# Altium schematic sheet RA3003-A-1.SchDoc
size A4
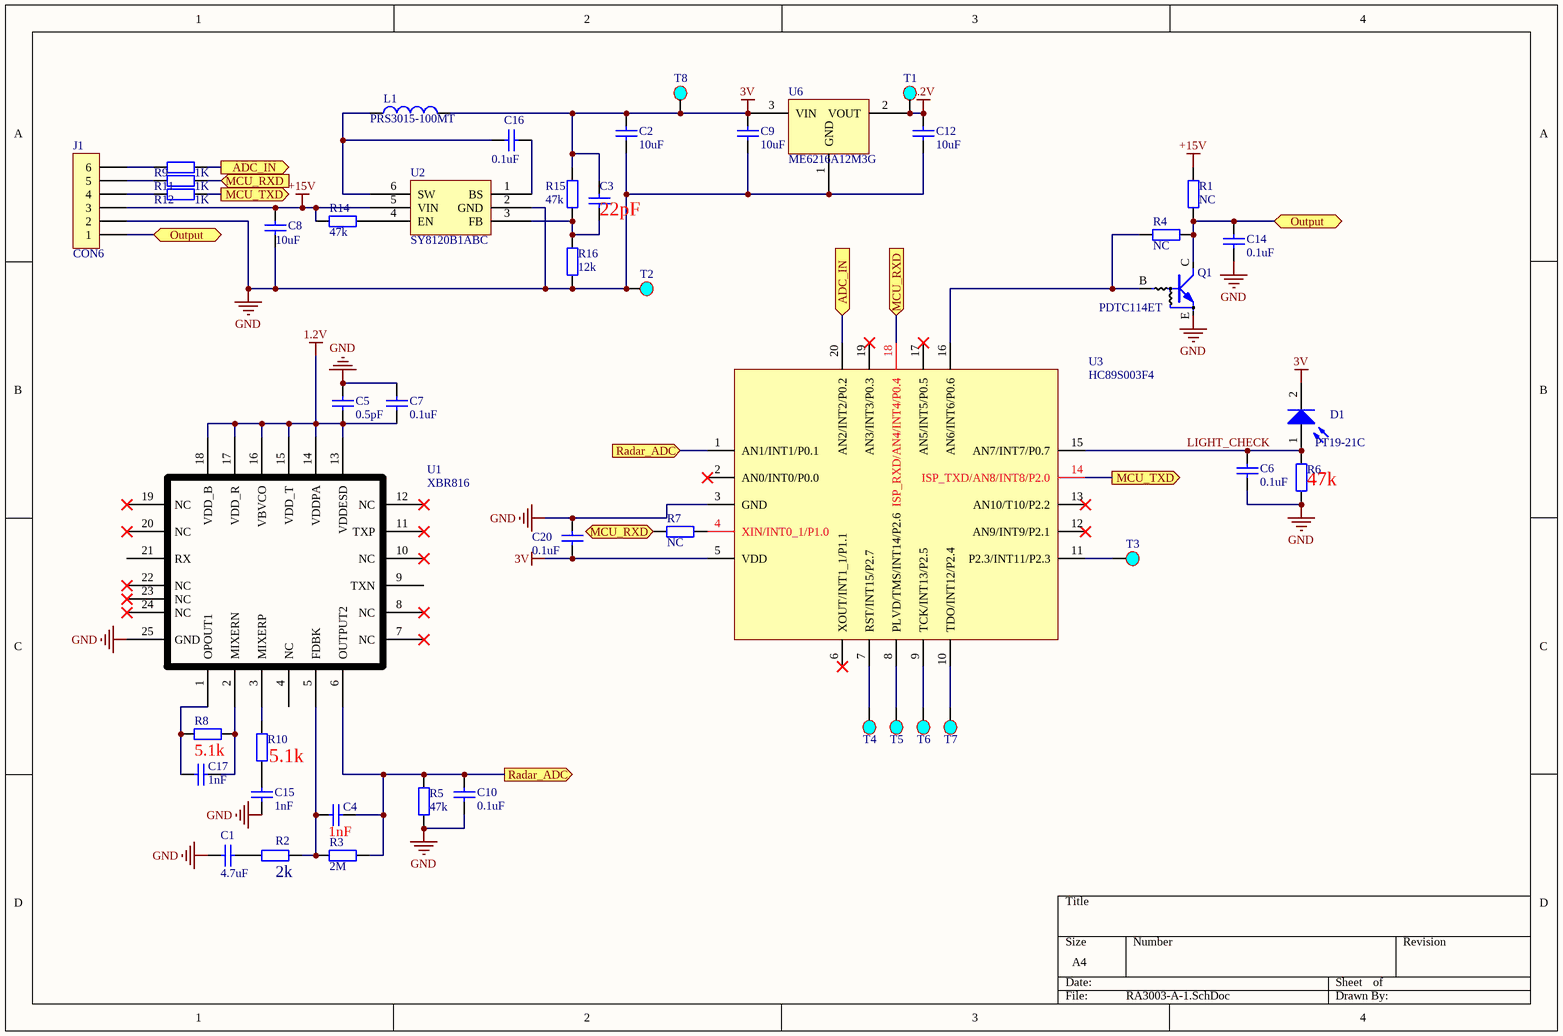
[diagram p0: RA3003-A-1.SchDoc]

## Parts
C1  4.7uF  [C0402]
C2  10uF  [C0402]
C3  22pF  [C0402]
C4  1nF  [C0402]
C5  0.5pF  [C0402]
C6  0.1uF  [C0402]
C7  0.1uF  [C0402]
C8  10uF  [C0603]
C9  10uF  [C0402]
C10  0.1uF  [C0402]
C12  10uF  [C0402]
C14  0.1uF  [C0402]
C15  1nF  [C0402]
C16  0.1uF  [C0402]
C17  1nF  [C0402]
C20  0.1uF  [C0402]
D1  PT19-21C  [LED-0603]
J1  CON6  [CON 6PIN-1-2.0-DIP-P]
L1  PRS3015-100MT  [PRS3015]
Q1  PDTC114ET  [SOT-23(BEC)]
R1  NC  [R0402]
R2  2k  [R0402]
R3  2M  [R0402]
R4  NC  [R0402]
R5  47k  [R0402]
R6  47k  [R0402]
R7  NC  [R0402]
R8  5.1k  [R0402]
R9  1K  [R0402]
R10  5.1k  [R0402]
R11  1K  [R0402]
R12  1K  [R0402]
R14  47k  [R0402]
R15  47k  [R0402]
R16  12k  [R0402]
T1  (no value)  [TestPoints]
T2  (no value)  [TestPoints]
T3  (no value)  [TestPoints]
T4  (no value)  [TestPoints]
T5  (no value)  [TestPoints]
T6  (no value)  [TestPoints]
T7  (no value)  [TestPoints]
T8  (no value)  [TestPoints]
U1  XBR816  [XBR816]
U2  SY8120B1ABC  [SOT-23-6]
U3  HC89S003F4  [QFN20(3*3)]
U6  ME6216A12M3G  [SOT-23-L]

## Ports
ADC_IN (in), ADC_IN (out), MCU_RXD (in), MCU_TXD (out), Output (bidir), Radar_ADC (in), Radar_ADC (out)

## Nets
1.2V: C5.1 C7.1 C12.1 T1.1 U1.13(VDDESD) U1.14(VDDPA) U1.15(VDD_T) U1.16(VBVCO) U1.17(VDD_R) U1.18(VDD_B) U6.2(VOUT)
3V: C2.1 C3.2 C9.1 C20.2 D1.2(K) L1.2 R15.2 T8.1 U3.5(VDD) U6.3(VIN)
+15V: C8.1 J1.3 R1.1 R14.2 U2.5(VIN)
GND: C1.2 C2.2 C5.2 C6.2 C7.2 C8.2 C9.2 C10.2 C12.2 C14.2 C15.1 C20.1 J1.2 Q1.E(e) R5.2 R6.2 R16.1 T2.1 U1.25(GND) U2.2(GND) U3.3(GND) U6.1(GND)
ADC_IN: R9.1 U3.20(AN2/INT2/P0.2) ; port ADC_IN
LIGHT_CHECK: C6.1 D1.1(A) R6.1 U3.15(AN7/INT7/P0.7)
MCU_RXD: R7.1 R11.1 U3.18(ISP_RXD/AN4/INT4/P0.4) ; port MCU_RXD
MCU_TXD: R12.1 U3.14(ISP_TXD/AN8/INT8/P2.0) ; port MCU_TXD
Output: C14.1 J1.1 Q1.C(c) R1.2 R4.2 ; port Output
Radar_ADC: C4.1 C10.1 R3.1 R5.1 U1.6(OUTPUT2) U3.1(AN1/INT1/P0.1) ; port Radar_ADC
NetC1_1: C1.1 R2.1
NetC3_1: C3.1 R15.1 R16.2 U2.3(FB)
NetC4_2: C4.2 R2.2 R3.2 U1.5(FDBK)
NetC15_2: C15.2 R10.2
NetC16_1: C16.1 L1.1 U2.6(SW)
NetC16_2: C16.2 U2.1(BS)
NetC17_1: C17.1 R8.1 U1.2(MIXERN)
NetC17_2: C17.2 R8.2 U1.1(OPOUT1)
NetJ1_4: J1.4 R12.2
NetJ1_5: J1.5 R11.2
NetJ1_6: J1.6 R9.2
NetQ1_B: Q1.B(b) R4.1 U3.16(AN6/INT6/P0.6)
NetR7_2: R7.2 U3.4(XIN/INT0_1/P1.0)
NetR10_1: R10.1 U1.3(MIXERP)
NetR14_1: R14.1 U2.4(EN)
NetT3_1: T3.1 U3.11(P2.3/INT11/P2.3)
NetT4_1: T4.1 U3.7(RST/INT15/P2.7)
NetT5_1: T5.1 U3.8(PLVD/TMS/INT14/P2.6)
NetT6_1: T6.1 U3.9(TCK/INT13/P2.5)
NetT7_1: T7.1 U3.10(TDO/INT12/P2.4)

Not connected (* = marked no-connect by the designer): U1 4(NC) 7(NC)* 8(NC)* 9(TXN) 10(NC)* 11(TXP)* 12(NC)* 19(NC)* 20(NC)* 21(RX) 22(NC)* 23(NC)* 24(NC)*; U3 2(AN0/INT0/P0.0)* 6(XOUT/INT1_1/P1.1)* 12(AN9/INT9/P2.1)* 13(AN10/T10/P2.2)* 17(AN5/INT5/P0.5)* 19(AN3/INT3/P0.3)*

## Library data of the parts
C1-C10 C12 C14-C17 C20 = Cap: Capacitor; Published: 8-Jun-2000; LatestRevisionDate: 17-Jul-2002; LatestRevisionNote: Re-released for DXP Platform.; PackageReference: RAD-0.3; Publisher: Altium Limited; PackageDescription: Radial Cap, Thru-Hole; 2 Leads; 0.3 in Pin Spacing
  C1: Value: 4.7uF
  C2 C8 C9 C12: Value: 10uF
  C3: Value: 22pF
  C4 C15 C17: Value: 1nF
  C5: Value: 0.5pF
  C6 C7 C10 C14 C16 C20: Value: 0.1uF
D1 = Photo Sen: Photosensitive Diode; Published: 24-Mar-1999; LatestRevisionDate: 17-Jul-2002; LatestRevisionNote: Re-released for DXP Platform.; PackageReference: PIN2; Publisher: Altium Limited; Value: PT19-21C
J1 = CON6: Connector
L1 = Inductor: Code_IEC: 1005; Published: 8-Jun-2000; LatestRevisionDate: 29-May-2009; LatestRevisionNote: IPC-7351 Footprint Added.; PackageReference: 0402-A; Publisher: Altium Limited; PackageDescription: Chip Inductor; Code_JEITA: 0402; Value: PRS3015-100MT
Q1 = PDTC114ET: 三极管
R1-R12 R14-R16 = Res2: Resistor; Published: 8-Jun-2000; LatestRevisionDate: 17-Jul-2002; LatestRevisionNote: Re-released for DXP Platform.; PackageReference: AXIAL-0.4; Publisher: Altium Limited; PackageDescription: Axial Device, Thru-Hole; 2 Leads; 0.4 in Pin Spacing
  R1 R4 R7: Value: NC
  R2: Value: 2k
  R3: Value: 2M
  R5 R6 R14 R15: Value: 47k
  R8 R10: Value: 5.1k
  R9 R11 R12: Value: 1K
  R16: Value: 12k
T1-T8 = TestPoints
U1 = XBR1000_24_1
U2 = H9108
U3 = HC89S003F4: MCU
U6 = SSP6206